# EAGLE design GBZP-no-mcu (EAGLE 8.0.0)
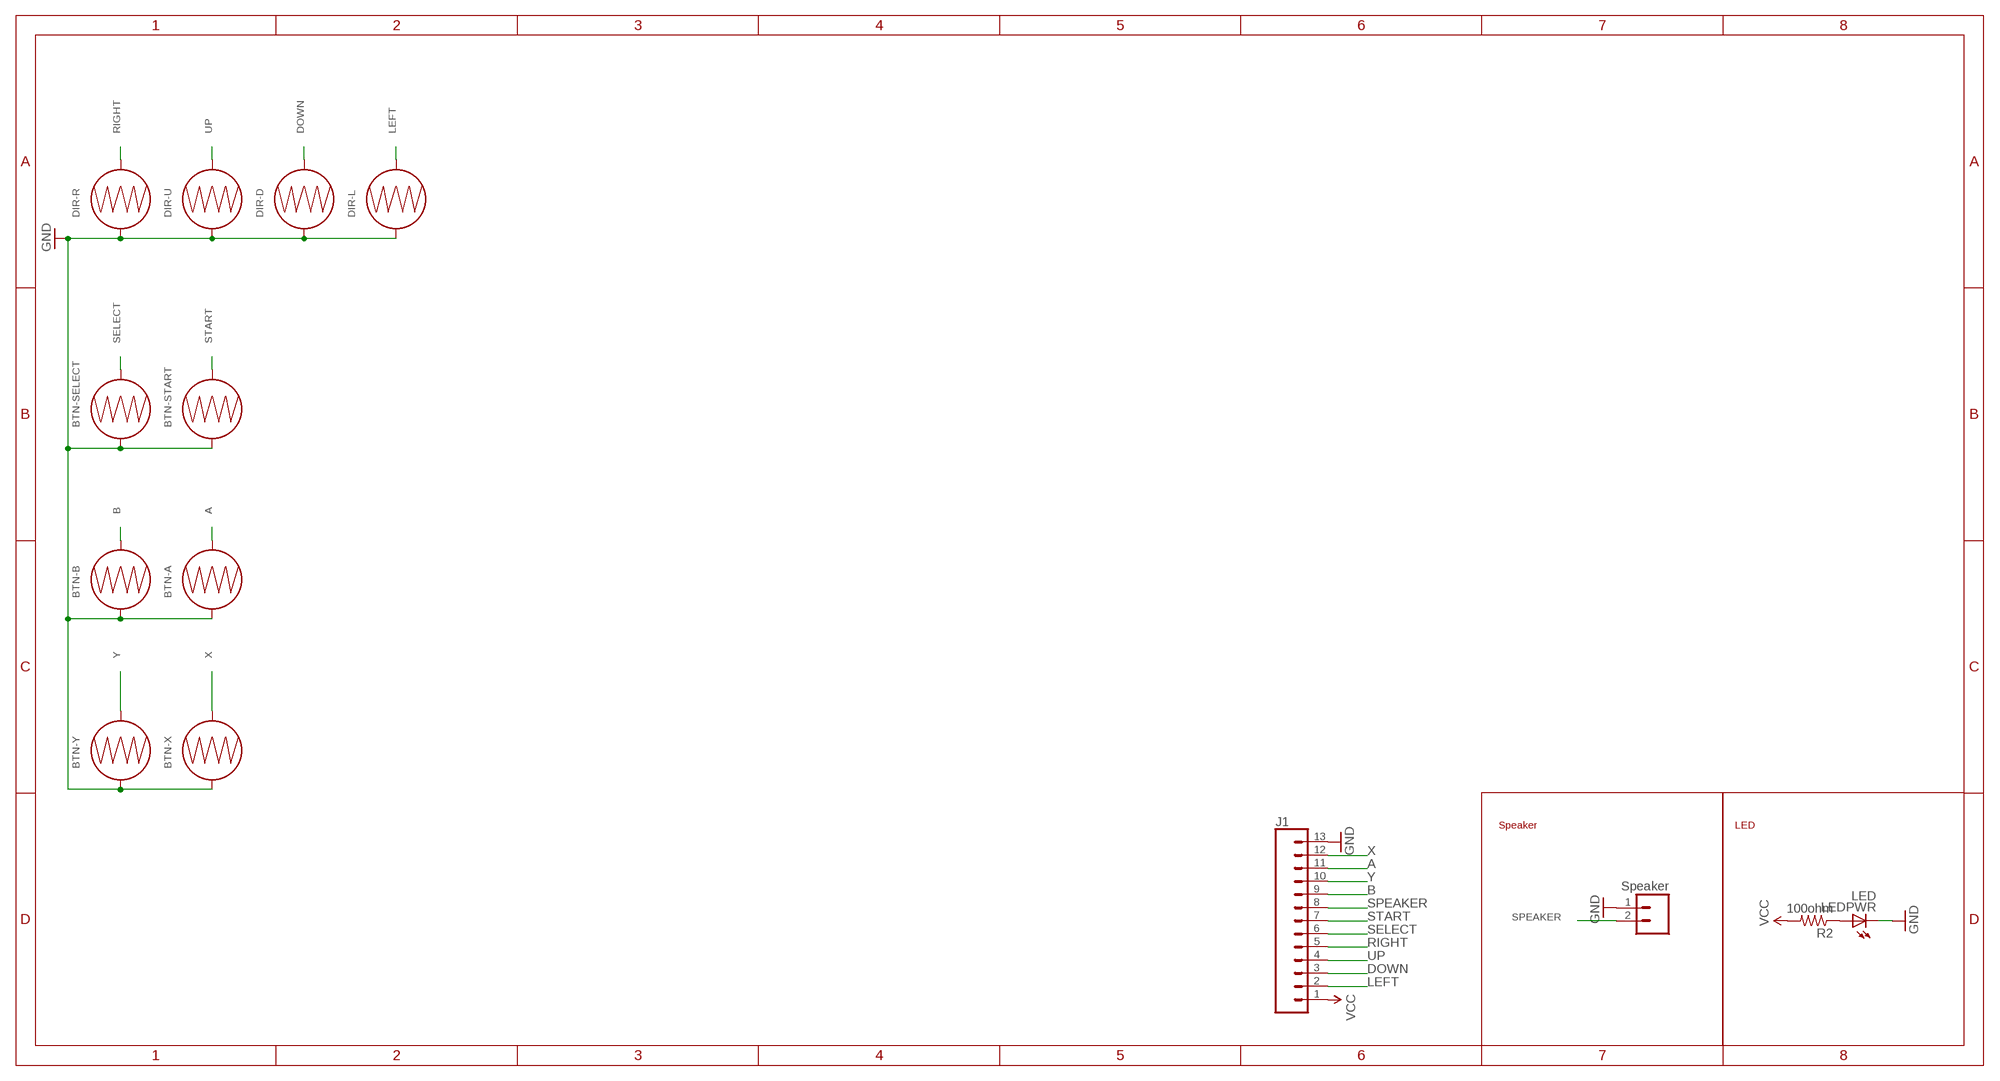
[diagram p0: schematic, sheet 1]

## Parts
BTN-A  BUTTON-CONDUCTIVESMD  [BUTTON-CONDUCTIVE]
BTN-B  BUTTON-CONDUCTIVESMD  [BUTTON-CONDUCTIVE]
BTN-SELECT  BUTTON-CONDUCTIVESMD  [BUTTON-CONDUCTIVE]
BTN-START  BUTTON-CONDUCTIVESMD  [BUTTON-CONDUCTIVE]
BTN-X  BUTTON-CONDUCTIVESMD  [BUTTON-CONDUCTIVE]
BTN-Y  BUTTON-CONDUCTIVESMD  [BUTTON-CONDUCTIVE]
DIR-D  BUTTON-CONDUCTIVESMD  [BUTTON-CONDUCTIVE]
DIR-L  BUTTON-CONDUCTIVESMD  [BUTTON-CONDUCTIVE]
DIR-R  BUTTON-CONDUCTIVESMD  [BUTTON-CONDUCTIVE]
DIR-U  BUTTON-CONDUCTIVESMD  [BUTTON-CONDUCTIVE]
J1  CONN_13  [1X13]
JP2  Speaker  M021X02_NO_SILK  [1X02_NO_SILK]
LEDPWR  LED  LEDCHIPLED_0805  [CHIPLED_0805]
R2  100ohm  R-US_R0805  [R0805]

## Nets
A: BTN-A.2 J1.11
B: BTN-B.2 J1.9
DOWN: DIR-D.2 J1.3
GND: BTN-A.1 BTN-B.1 BTN-SELECT.1 BTN-START.1 BTN-X.1 BTN-Y.1 DIR-D.1 DIR-L.1 DIR-R.1 DIR-U.1 J1.13 JP2.1 LEDPWR.C
LEFT: DIR-L.2 J1.2
N$2: LEDPWR.A R2.1
RIGHT: DIR-R.2 J1.5
SELECT: BTN-SELECT.2 J1.6
SPEAKER: J1.8 JP2.2
START: BTN-START.2 J1.7
UP: DIR-U.2 J1.4
VCC: J1.1 R2.2
X: BTN-X.2 J1.12
Y: BTN-Y.2 J1.10

## Notes on the sheet
- Speaker | LED

## Library data of the parts
BTN-A BTN-B BTN-SELECT BTN-START BTN-X BTN-Y DIR-D DIR-L DIR-R DIR-U = SparkFun-Electromechanical:BUTTON-CONDUCTIVE: Used with rubber key pads. This one was designed and proven to work with the PolyCase Key FOB enclosures.
J1 = SparkFun-Connectors:CONN_13: Multi connection point. Often used as Generic Header-pin footprint for 0.1 inch spaced/style header connections On any of the 0.1 inch spaced packages, you can populate with these: Break Away Headers - Straight <https://www.sparkfun.com/products/116> (PRT-00116) Break Away Male Headers - Right Angle <https://www.sparkfun.com/products/553> (PRT-00553) Female Headers <https://www.sparkfun.com/products/115> (PRT-00115) Break Away Headers - Machine Pin <https://www.sparkfun.com/products/117> (PRT-00117) Break Away Female Headers - Swiss Machine Pin <https://www.sparkfun.com/products/743> (PRT-00743) For SCREWTERMINALS and SPRING TERMINALS visit here: Screw Terimnals on SparkFun.com <https://www.sparkfun.com/search/results?term=Screw+Terminals> (5mm/3.5mm/2.54mm spacing) This device is also useful as a general connection point to wire up your design to another part of your project. Our various solder wires solder well into these plated through hole pads. Hook-Up Wire - Assortment (Stranded, 22 AWG) <https://www.sparkfun.com/products/11375> (PRT-11375) Hook-Up Wire - Assortment (Solid Core, 22 AWG) <https://www.sparkfun.com/products/11367> (PRT-11367) View the entire wire category on our website here <https://www.sparkfun.com/categories/141> Special notes: Molex polarized connector foot print use with SKU : PRT-08231 with associated crimp pins and housings. 1MM SMD Version SKU: PRT-10208 NOTES ON THE VARIANTS LOCK and LOCK_LONGPADS... This footprint was designed to help hold the alignment of a through-hole component (i.e. 6-pin header) while soldering it into place. You may notice that each hole has been shifted either up or down by 0.005 of an inch from it's more standard position (which is a perfectly straight line). This slight alteration caused the pins (the squares in the middle) to touch the edges of the holes. Because they are alternating, it causes a "brace" to hold the component in place. 0.005 has proven to be the perfect amount of "off-center" position when using our standard breakaway headers. Although looks a little odd when you look at the bare footprint, once you have a header in there, the alteration is very hard to notice. Also,if you push a header all the way into place, it is covered up entirely on the bottom side.
JP2 = SparkFun-Connectors:M02: Standard 2-pin 0.1" header. Use with - straight break away headers ( PRT-00116) - right angle break away headers (PRT-00553) - swiss pins (PRT-00743) - machine pins (PRT-00117) - female headers (PRT-00115) Molex polarized connector foot print use with: PRT-08233 with associated crimp pins and housings. 2.54_SCREWTERM for use with PRT-10571. 3.5mm Screw Terminal footprints for PRT-08084 5mm Screw Terminal footprints for use with PRT-08432
LEDPWR = adafruit:LED: LED OSRAM: - CHIPLED LG R971, LG N971, LY N971, LG Q971, LY Q971, LO R971, LY R971 LH N974, LH R974 LS Q976, LO Q976, LY Q976 LO Q996 - Hyper CHIPLED LW Q18S LB Q993, LB Q99A, LB R99A - SideLED LS A670, LO A670, LY A670, LG A670, LP A670 LB A673, LV A673, LT A673, LW A673 LH A674 LY A675 LS A676, LA A676, LO A676, LY A676, LW A676 LS A679, LY A679, LG A679 - Hyper Micro SIDELED® LS Y876, LA Y876, LO Y876, LY Y876 LT Y87S - SmartLED LW L88C, LW L88S LB L89C, LB L89S, LG L890 LS L89K, LO L89K, LY L89K LS L896, LA L896, LO L896, LY L896 - TOPLED LS T670, LO T670, LY T670, LG T670, LP T670 LSG T670, LSP T670, LSY T670, LOP T670, LYG T670 LG T671, LOG T671, LSG T671 LB T673, LV T673, LT T673, LW T673 LH T674 LS T676, LA T676, LO T676, LY T676, LB T676, LH T676, LSB T676, LW T676 LB T67C, LV T67C, LT T67C, LS T67K, LO T67K, LY T67K, LW E67C LS E67B, LA E67B, LO E67B, LY E67B, LB E67C, LV E67C, LT E67C LW T67C LS T679, LY T679, LG T679 LS T770, LO T770, LY T770, LG T770, LP T770 LB T773, LV T773, LT T773, LW T773 LH T774 LS E675, LA E675, LY E675, LS T675 LS T776, LA T776, LO T776, LY T776, LB T776 LHGB T686 LT T68C, LB T68C - Hyper Mini TOPLED® LB M676 - Mini TOPLED Santana® LG M470 LS M47K, LO M47K, LY M47K Source: http://www.osram.convergy.de/
R2 = adafruit:R-US_: RESISTOR, American symbol

## Board
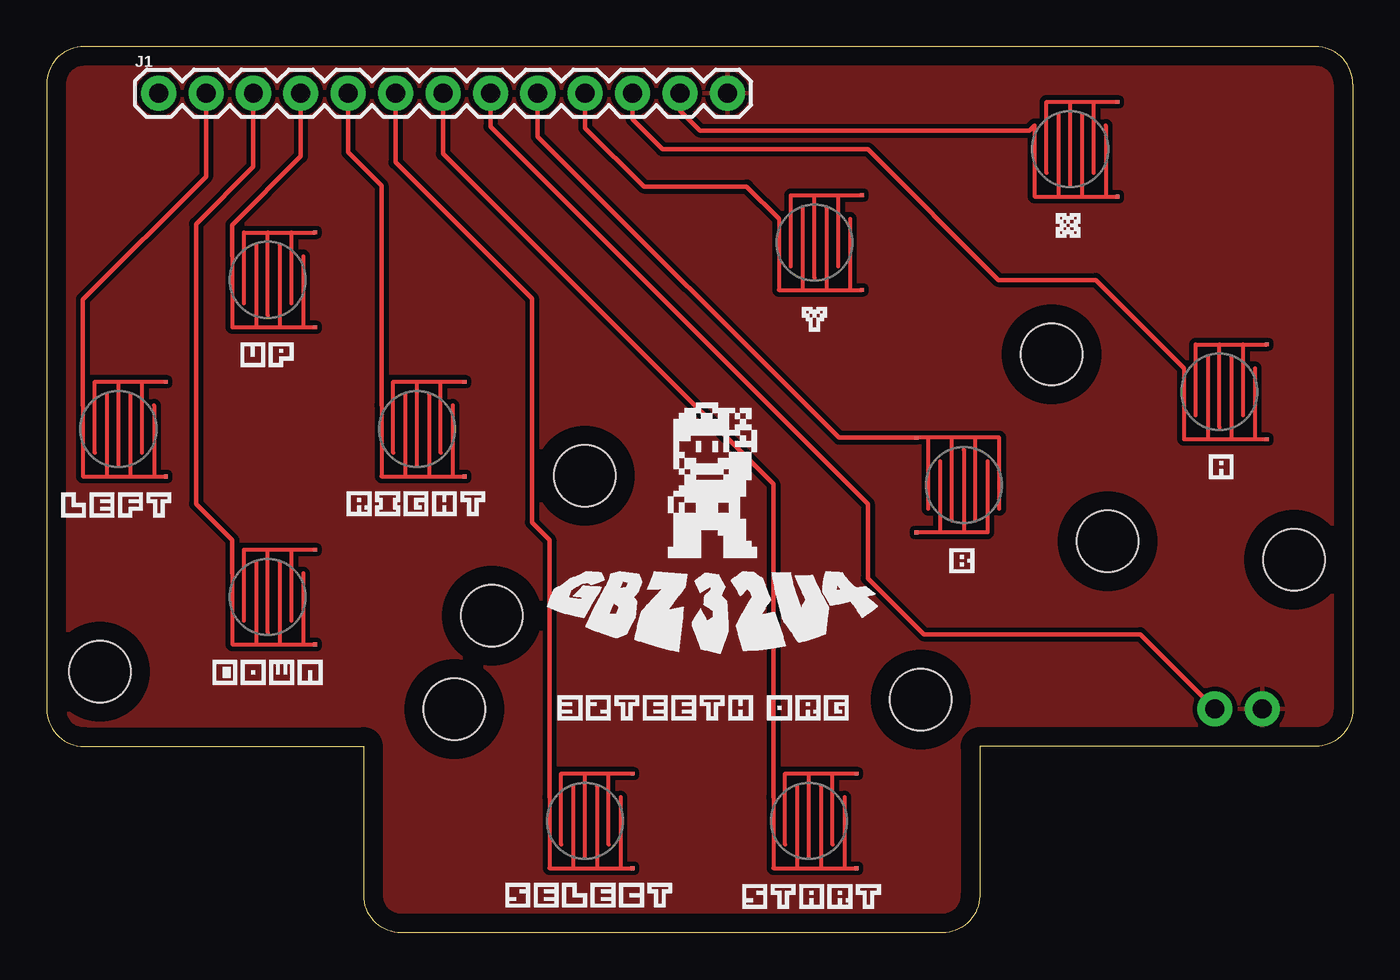
[diagram p1: board, top side]
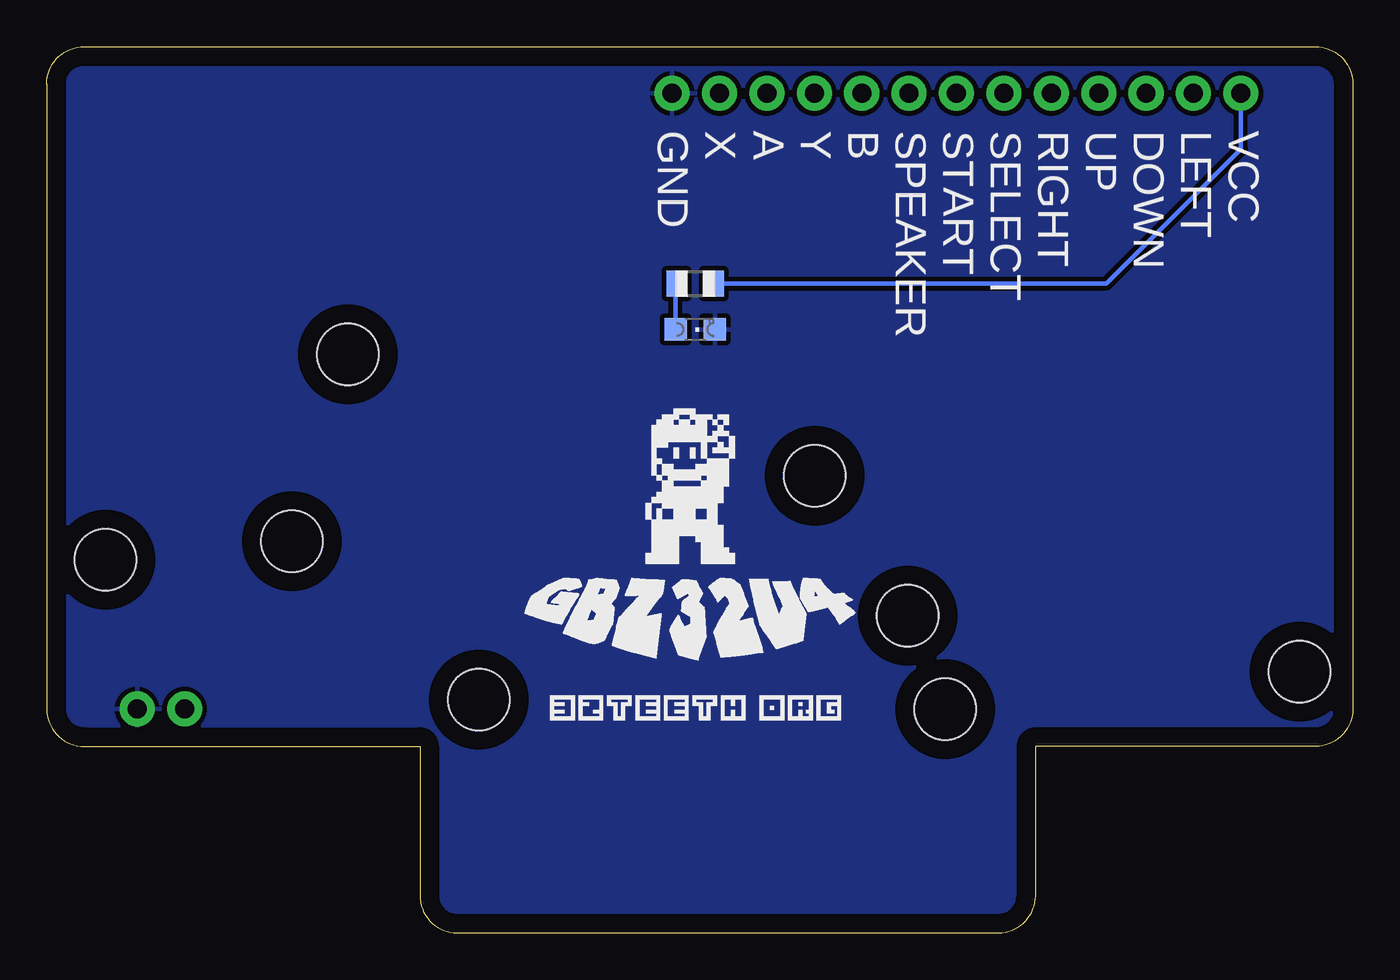
[diagram p2: board, bottom side, seen from below]

Size 70 x 47.5 mm. Coordinates in mm from the lower left corner, seen from the top.
Outline: 70,45.5 70,12 arc-90 68,10 50,10 50,2 arc-90 48,0 19,0 arc-90 17,2 17,10 2,10 arc-90 0,12 0,45.5 arc-90 2,47.5 68,47.5 arc-90 70,45.5
Copper layers (1*16): Top 0.035mm / dielectric 1.5mm / Bottom 0.035mm
Design rules "default *": minimum track width 10mil, minimum drill 20mil, track to track 10mil, track to pad 10mil, pad to pad 10mil, via to via 10mil, smd to smd 10mil, copper to edge 40mil, drill to drill 20mil, minimum pad ring 10mil, minimum via ring 8mil, stop-mask expansion 4mil, vias tented up to drill 20mil, thermal gap 10mil

### Footprints (pad centres in the part's own frame; a part is rotated, then mirrored left to right if it is on the bottom)
BUTTON-CONDUCTIVE = smd 0.203 x 0.203: 1 2.54,2.54; 2 2.54,-2.54
1X13 = drill 1.016 pad 1.88: 1 0,0; 2 2.54,0; 3 5.08,0; 4 7.62,0; 5 10.16,0; 6 12.7,0; 7 15.24,0; 8 17.78,0; 9 20.32,0; 10 22.86,0; 11 25.4,0; 12 27.94,0; 13 30.48,0
1X02_NO_SILK = drill 1.016 pad 1.88: 1 0,0; 2 2.54,0
CHIPLED_0805 = smd 1.2 x 1.2: A 0,-1.05; C 0,1.05
R0805 = smd 1.1 x 1.4: 1 -1,0; 2 1,0
STAND-OFF = hole 3.302: 0,0

### Placement (x,y rotation side)
BTN-A  62.85,29 0 top
BTN-B  49.15,24 180 top
BTN-SELECT  28.85,6 0 top
BTN-START  40.85,6 0 top
BTN-X  54.85,42 0 top
BTN-Y  41.15,37 0 top
DIR-D  11.85,18 0 top
DIR-L  3.85,27 0 top
DIR-R  19.85,27 0 top
DIR-U  11.85,35 0 top
J1  6,45 0 top
JP2  65.15,12 180 top
LEDPWR  35.24,32.34 270 bottom
R2  35.24,34.8 0 bottom
U$3  [STAND-OFF]  2.85,14 90 top
U$4  [STAND-OFF]  46.85,12.5 90 top
U$5  [STAND-OFF]  66.85,20 90 top
U$6  [STAND-OFF]  28.85,24.5 90 top
U$7  [STAND-OFF]  23.85,17 90 top
U$9  [STAND-OFF]  56.85,21 90 top
U$10  [STAND-OFF]  21.85,12 90 top
U$11  [STAND-OFF]  53.85,31 90 top

### Tracks (layer width: path | path; a pad name or v marks a point on that pad's centre or on a via)
A
  Top 0.254: J1.11 31.4,43.6 33,42 44,42 51,35 56.22,35 60.95,30.27
B
  Top 0.254: J1.9 26.32,42.68 42.46,26.54 BTN-B.2
DOWN
  Top 0.254: J1.3 11.08,41.08 8,38 8,23 9.95,21.05 9.95,19.27
GND
  pour Bottom: 0,47.5 70,47.5 70,10 50,10 50,0 17,0 17,10 0,10
  pour Top: 0,47.5 70,47.5 70,10 50,10 50,0 17,0 17,10 0,10
LEFT
  Top 0.254: J1.2 8.54,40.54 1.95,33.95 1.95,28.27
N$2
  Bottom 0.254: LEDPWR.A 36.29,34.75 R2.1
RIGHT
  Top 0.254: J1.5 16.16,41.84 17.95,40.05 17.95,28.27
SELECT
  Top 0.254: J1.6 18.7,41.3 26,34 26,22 26.95,21.05 26.95,7.27
SPEAKER
  Top 0.254: J1.8 23.78,43.22 44,23 44,19 47,16 58.61,16 JP2.2
START
  Top 0.254: J1.7 21.24,41.76 38.95,24.05 38.95,7.27
UP
  Top 0.254: J1.4 13.62,41.62 9.95,37.95 9.95,36.27
VCC
  Bottom 0.254: R2.2 13.2,34.8 6,42 J1.1
X
  Top 0.254: J1.12 33.94,44.06 35,43 52.67,43 52.95,43.27
Y
  Top 0.254: J1.10 28.86,43.14 32,40 37.52,40 39.24,38.27

### Text on the board
bPlace: VCC / LEFT / DOWN / UP / RIGHT / SELECT / START / SPEAKER / B / Y / A / X / GND